# Altium schematic sheet Main.SchDoc
size A4; SheetNumber: 1; SheetTotal: 11
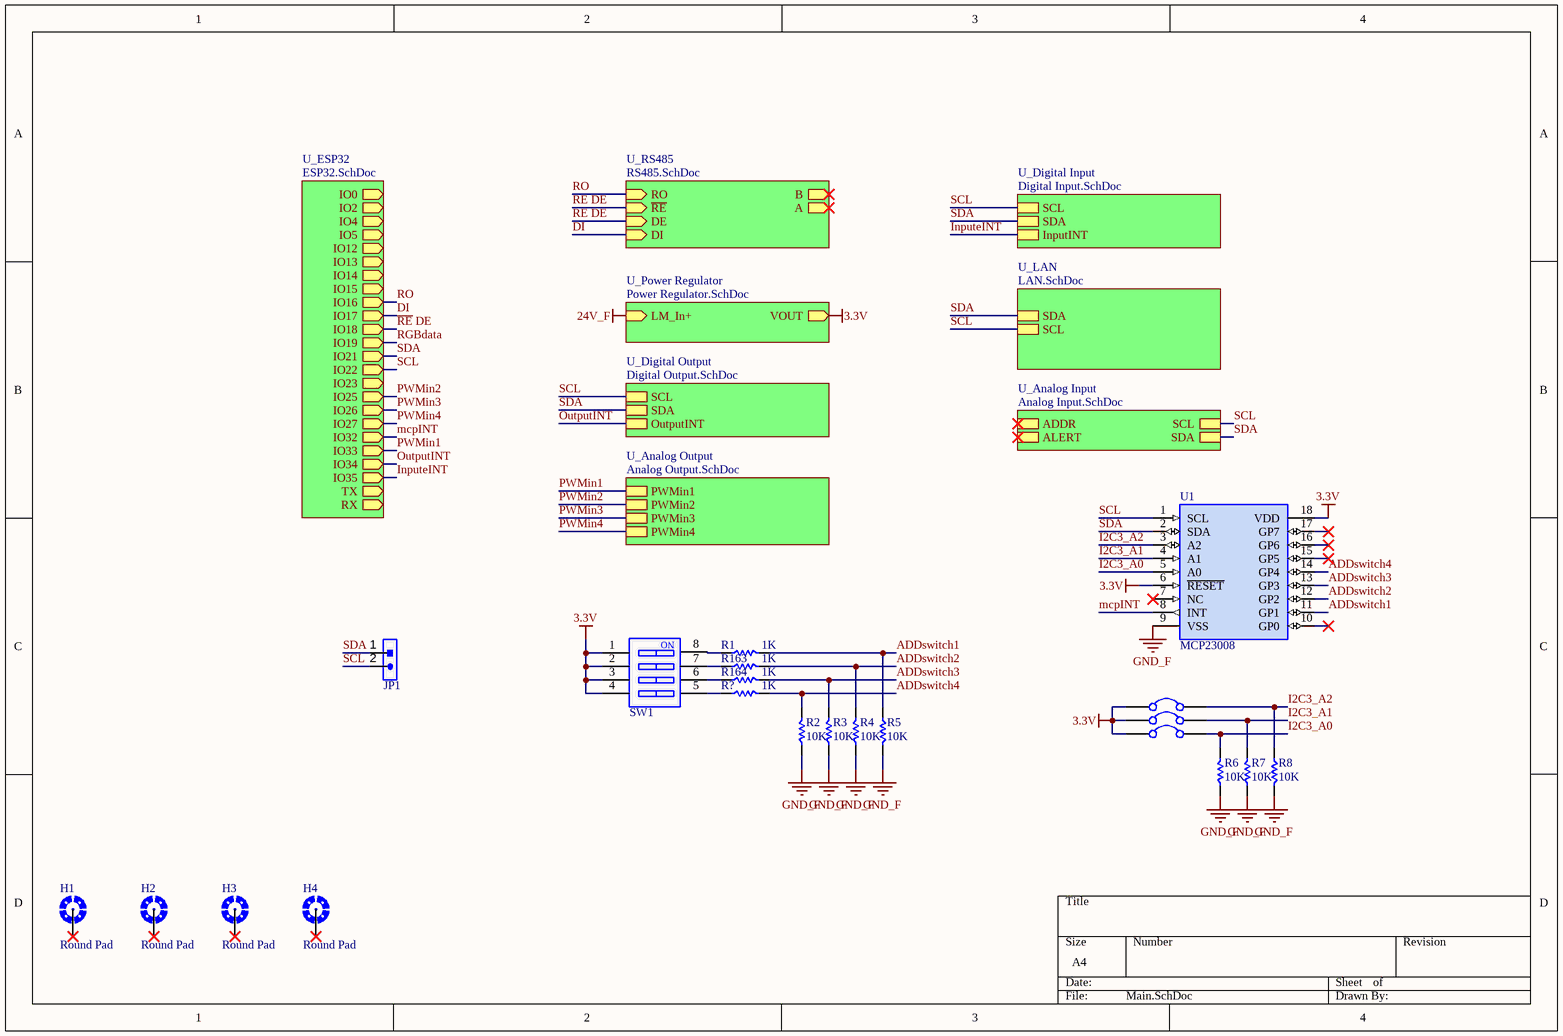
[diagram p0: Main.SchDoc]

## Parts
H1  Round Pad  [P2.8CH]  (no BOM)
H2  Round Pad  [P2.8CH]  (no BOM)
H3  Round Pad  [P2.8CH]  (no BOM)
H4  Round Pad  [P2.8CH]  (no BOM)
JP1  HDR-1X2  [HDR-1X2_M]  (value not drawn)
R1  1K  [R 0805]
R2  10K  [R 0805]
R3  10K  [R 0805]
R4  10K  [R 0805]
R5  10K  [R 0805]
R6  10K  [R 0805]
R7  10K  [R 0805]
R8  10K  [R 0805]
R163  1K  [R 0805]
R164  1K  [R 0805]
R?  1K  [R 0805]
SB1  Solder Bridge  [Solder Bridge Open]  (value not drawn)
SB2  Solder Bridge  [Solder Bridge Open]  (value not drawn)
SB3  Solder Bridge  [Solder Bridge Open]  (value not drawn)
SW1  CSW-4P  [CSW DIP-4P_G]  (value not drawn)
U1  MCP23008  [SOP18W_M]

## Sub-sheets
U_Analog Input = Analog Input.SchDoc: ADDR, ALERT, SCL, SDA
U_Analog Output = Analog Output.SchDoc: PWMin1, PWMin2, PWMin3, PWMin4
U_Digital Input = Digital Input.SchDoc: SCL, SDA, InputINT
U_Digital Output = Digital Output.SchDoc: SCL, SDA, OutputINT
U_ESP32 = ESP32.SchDoc: IO2 (out), IO4 (out), IO5 (out), IO12 (out), IO13 (out), IO14 (out), IO15 (out), IO16 (out), IO17 (out), IO18 (out), IO19 (out), IO21 (out), IO22 (out), IO23 (out), IO25 (out), IO26 (out), IO27 (out), IO32 (out), IO33 (out), IO34 (out), IO35 (out), IO0 (out), TX (out), RX (out)
U_LAN = LAN.SchDoc: SDA, SCL
U_Power Regulator = Power Regulator.SchDoc: LM_In+ (in), VOUT (out)
U_RS485 = RS485.SchDoc: RO (in), ~{RE} (in), DE (in), DI (in), B (out), A (out)

## Nets
3.3V: SB1.1 SB2.1 SB3.1 SW1.1 SW1.2 SW1.3 SW1.4 U1.6(~{RESET}) U1.18(VDD) ; sheet U_Power Regulator/VOUT
24V_F: sheet U_Power Regulator/LM_In+
GND_F: R2.1 R3.1 R4.1 R5.2 R6.1 R7.1 R8.2 U1.9(VSS)
SHIELD: H1.P(Pad) H2.P(Pad) H3.P(Pad) H4.P(Pad)
ADDswitch1: R1.2 R5.1 U1.11(GP1)
ADDswitch2: R4.2 R163.2 U1.12(GP2)
ADDswitch3: R3.2 R164.2 U1.13(GP3)
ADDswitch4: R2.2 R?.2 U1.14(GP4)
DI: sheet U_ESP32/IO17, sheet U_RS485/DI
I2C3_A0: R6.2 SB3.2 U1.5(A0)
I2C3_A1: R7.2 SB2.2 U1.4(A1)
I2C3_A2: R8.1 SB1.2 U1.3(A2)
InputeINT: sheet U_ESP32/IO35, sheet U_Digital Input/InputINT
mcpINT: U1.8(INT) ; sheet U_ESP32/IO32
OutputINT: sheet U_ESP32/IO34, sheet U_Digital Output/OutputINT
PWMin1: sheet U_ESP32/IO33, sheet U_Analog Output/PWMin1
PWMin2: sheet U_ESP32/IO25, sheet U_Analog Output/PWMin2
PWMin3: sheet U_ESP32/IO26, sheet U_Analog Output/PWMin3
PWMin4: sheet U_ESP32/IO27, sheet U_Analog Output/PWMin4
~{RE} DE: sheet U_ESP32/IO18, sheet U_RS485/~{RE}, sheet U_RS485/DE
RGBdata: sheet U_ESP32/IO19
RO: sheet U_ESP32/IO16, sheet U_RS485/RO
SCL: JP1.2 U1.1(SCL) ; sheet U_ESP32/IO22, sheet U_Digital Output/SCL, sheet U_Digital Input/SCL, sheet U_LAN/SCL, sheet U_Analog Input/SCL
SDA: JP1.1 U1.2(SDA) ; sheet U_ESP32/IO21, sheet U_Digital Output/SDA, sheet U_Digital Input/SDA, sheet U_LAN/SDA, sheet U_Analog Input/SDA
NetR1_1: R1.1 SW1.8
NetR163_1: R163.1 SW1.7
NetR164_1: R164.1 SW1.6
NetR?_1: R?.1 SW1.5

Not connected (* = marked no-connect by the designer): U1 7(NC)* 10(GP0)* 15(GP5)* 16(GP6)* 17(GP7)*

## Notes on the sheet
- (in symbol CSW-4P) NO

## Library data of the parts
H1-H4 = MOUNT-PAD-ROUND-HOLES: MOUNTING PAD, round with holes around
JP1 = Header 2: 2P Connector; BOM名称: 2P接插件; 版权归属: 源创客; 学习资源: www.ooocke.com
R1-R8 R163 R164 R? = R: Chip resistor; 版权归属: 源创客; BOM名称: Chip resistor; 学习资源: www.ooocke.com
SW1 = CSW-4P: 4-way code switch; BOM名称: 4路编码开关; 版权归属: 源创客; 学习资源: www.ooocke.com
U1 = MCP23008: 8 Bit I/O Expander